# EAGLE design Eelctric Imp hydro board (EAGLE 6.5.0)
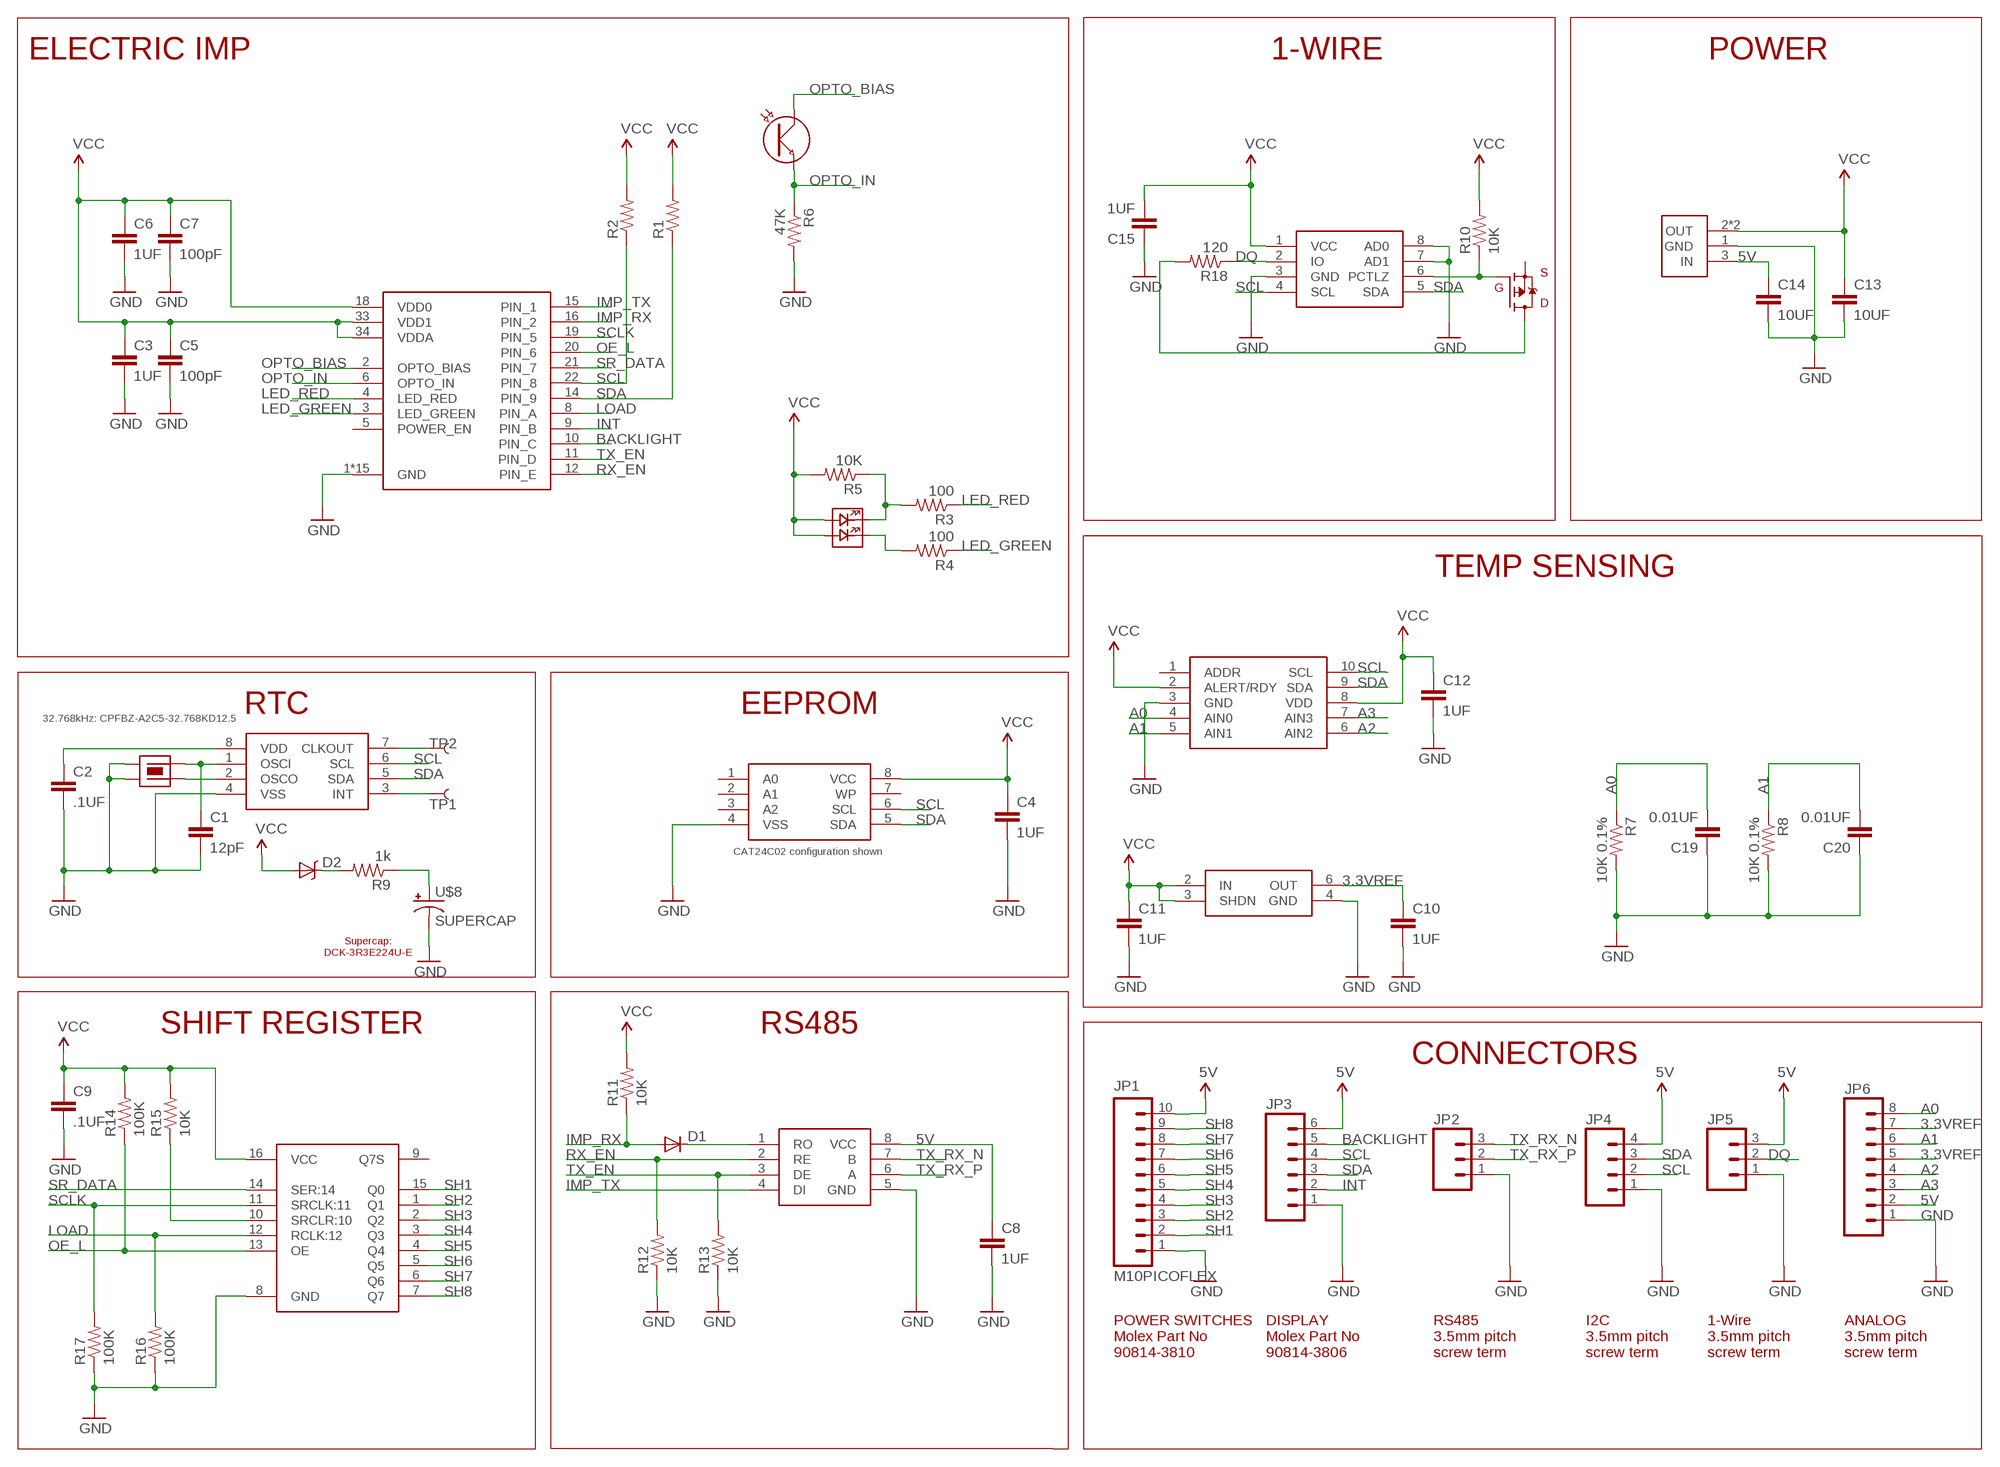
[diagram p0: schematic, sheet 1]

## Parts
C1  12pF  CAP0805  [0805]
C2  .1UF  CAP0805  [0805]
C3  1UF  CAP0805  [0805]
C4  1UF  CAP0805  [0805]
C5  100pF  CAP0805  [0805]
C6  1UF  CAP0805  [0805]
C7  100pF  CAP0805  [0805]
C8  1UF  CAP0805  [0805]
C9  .1UF  CAP0805  [0805]
C10  1UF  CAP0805  [0805]
C11  1UF  CAP0805  [0805]
C12  1UF  CAP0805  [0805]
C13  10UF  CAP0805  [0805]
C14  10UF  CAP0805  [0805]
C15  1UF  CAP0805  [0805]
C19  0.01UF  CAP0805  [0805]
C20  0.01UF  CAP0805  [0805]
D1  DIODESOD  [SOD-323]
D2  DIODE-SCHOTTKY_  [SMA-DIODE]
JP1  M10PICOFLEX  [CONNECTOR_MOLEX_PICOFLEX_10]
JP2  M03SCREW_LOCK  [SCREWTERMINAL-3.5MM-3_LOCK.007S]
JP3  M06PICOFLEX  [CONNECTOR_MOLEX_PICOFLEX_6]
JP4  M04SCREW_LOCK  [SCREWTERMINAL-3.5MM-4_LOCK]
JP5  M03SCREW_LOCK  [SCREWTERMINAL-3.5MM-3_LOCK.007S]
JP6  M083.5MM-8  [SCREWTERMINAL-3.5MM-8]
R1  RESISTOR0805-RES  [0805]
R2  RESISTOR0805-RES  [0805]
R3  100  RESISTOR0805-RES  [0805]
R4  100  RESISTOR0805-RES  [0805]
R5  10K  RESISTOR0805-RES  [0805]
R6  47K  RESISTOR0805-RES  [0805]
R7  10K 0.1%  RESISTOR0805-RES  [0805]
R8  10K 0.1%  RESISTOR0805-RES  [0805]
R9  1k  RESISTOR0805-RES  [0805]
R10  10K  RESISTOR0805-RES  [0805]
R11  10K  RESISTOR0805-RES  [0805]
R12  10K  RESISTOR0805-RES  [0805]
R13  10K  RESISTOR0805-RES  [0805]
R14  100K  RESISTOR0805-RES  [0805]
R15  10K  RESISTOR0805-RES  [0805]
R16  100K  RESISTOR0805-RES  [0805]
R17  100K  RESISTOR0805-RES  [0805]
R18  120  RESISTOR0805-RES  [0805]
TP1  TEST-POINT3  [PAD.03X.03]
TP2  TEST-POINT3  [PAD.03X.03]
U$1  RTC_PCF8563  [SOIC8]
U$2  CRYSTAL_4PIN232.768KHZ_ABS25  [CRYSTAL_ABS25]
U$3  EEPROM_CAT24CXX  [SOIC8]
U$4  RF_MODULE_IMP002  [RF_MODULE_IMP002]
U$5  LED_BI_COLOR_4PIN  [LED_LITEON_BICOLOR_TOP]
U$6  PHOTOTRANSISTOR0805  [0805POL]
U$8  SUPERCAP  [SUPERCAP_ELENA_DCK_3R3E224U-E]
U$9  DS2482-100  [SO08]
U$10  SHIFT_NXP_74HC595  [SO-16]
U$11  V_REG_LDO_3SOT-223-4_TI_TLV1117LV  [SOT223]
U$12  TRANSCEIVER_ST485  [SOIC8]
U$13  ADC_ADS1115  [MSOP10]
U$15  VREF_LT1461  [SOIC8]
U$16  MOSFET-P-CHANNELBSS84  [SOT23]

## Nets
3.3VREF: C10.1 JP6.5 JP6.7 U$15.6(OUT)
5V: C8.1 C14.1 JP1.10 JP3.6 JP4.4 JP5.3 JP6.2 U$11.3(IN) U$12.8(VCC)
A0: C19.2 JP6.8 R7.1 U$13.4(AIN0)
A1: C20.2 JP6.6 R8.1 U$13.5(AIN1)
A2: JP6.4 U$13.6(AIN2)
A3: JP6.3 U$13.7(AIN3)
BACKLIGHT: JP3.5 U$4.10(PIN_C)
DQ: JP5.2 R18.1 U$9.2(IO)
GND: C1.2 C2.2 C3.2 C4.2 C5.2 C6.2 C7.2 C8.2 C9.2 C10.2 C11.2 C12.2 C13.2 C14.2 C15.1 C19.1 C20.1 JP1.1 JP2.1 JP3.1 JP4.1 JP5.1 JP6.1 R6.2 R7.2 R8.2 R12.1 R13.1 R16.1 R17.1 U$1.4(VSS) U$2.2(CASE2) U$2.3(CASE1) U$3.4(VSS) U$4.1(GND) U$4.7(GND) U$4.13(GND) U$4.17(GND) U$4.23(GND) U$4.24(GND) U$4.25(GND) U$4.26(GND) U$4.27(GND) U$4.28(GND) U$4.29(GND) U$4.30(GND) U$4.31(GND) U$4.32(GND) U$4.35(GND) U$8.- U$9.3(GND) U$9.7(AD1) U$9.8(AD0) U$10.8(GND) U$11.1(GND) U$12.5(GND) U$13.3(GND) U$15.4(GND)
IMP_RX: D1.2(A) R11.1 U$4.16(PIN_2)
IMP_TX: U$4.15(PIN_1) U$12.4(DI)
INT: JP3.2 U$4.9(PIN_B)
LED_GREEN: R4.1 U$4.3(LED_GREEN)
LED_RED: R3.1 U$4.4(LED_RED)
LOAD: R16.2 U$4.8(PIN_A) U$10.12(RCLK:12)
N$1: R18.2 U$16.3(D)
N$2: C1.1 U$1.1(OSCI) U$2.1
N$3: U$1.2(OSCO) U$2.4
N$4: TP1.P$1 U$1.3(INT)
N$5: TP2.P$1 U$1.7(CLKOUT)
N$6: D2.C R9.2
N$8: R3.2 R5.1 U$5.LONG-
N$9: R15.1 U$10.10(SRCLR:10)
N$10: R4.2 U$5.SHORT-
N$12: R10.1 U$9.6(PCTLZ) U$16.1(G)
OE_L: R14.1 U$4.20(PIN_6) U$10.13(OE)
OPTO_BIAS: U$4.2(OPTO_BIAS) U$6.1(MARKING)(COLLECTOR)
OPTO_IN: R6.1 U$4.6(OPTO_IN) U$6.2(EMITTER)
RO: D1.1(C) U$12.1(RO)
RX_EN: R12.2 U$4.12(PIN_E) U$12.2(RE)
SCL: JP3.4 JP4.2 R2.1 U$1.6(SCL) U$3.6(SCL) U$4.22(PIN_8) U$9.4(SCL) U$13.10(SCL)
SCLK: R17.2 U$4.19(PIN_5) U$10.11(SRCLK:11)
SDA: JP3.3 JP4.3 R1.1 U$1.5(SDA) U$3.5(SDA) U$4.14(PIN_9) U$9.5(SDA) U$13.9(SDA)
SH1: JP1.2 U$10.15(Q0)
SH2: JP1.3 U$10.1(Q1)
SH3: JP1.4 U$10.2(Q2)
SH4: JP1.5 U$10.3(Q3)
SH5: JP1.6 U$10.4(Q4)
SH6: JP1.7 U$10.5(Q5)
SH7: JP1.8 U$10.6(Q6)
SH8: JP1.9 U$10.7(Q7)
SR_DATA: U$4.21(PIN_7) U$10.14(SER:14)
TX_EN: R13.2 U$4.11(PIN_D) U$12.3(DE)
TX_RX_N: JP2.3 U$12.7(B)
TX_RX_P: JP2.2 U$12.6(A)
VCC: C3.1 C4.1 C5.1 C6.1 C7.1 C9.1 C11.1 C12.1 C13.1 C15.2 D2.A R1.2 R2.2 R5.2 R10.2 R11.2 R14.2 R15.2 U$3.8(VCC) U$4.18(VDD0) U$4.33(VDD1) U$4.34(VDDA) U$5.LONG+ U$5.SHORT+ U$9.1(VCC) U$10.16(VCC) U$11.2(OUT) U$11.4(OUT) U$13.2(ALERT/RDY) U$13.8(VDD) U$15.2(IN) U$15.3(SHDN)
VCLK: C2.1 R9.1 U$1.8(VDD) U$8.+
Unconnected: U$3.1(A0) U$3.2(A1) U$3.3(A2) U$3.7(WP) U$4.5(POWER_EN) U$10.9(Q7S) U$13.1(ADDR) U$16.2(S)

## Notes on the sheet
- ELECTRIC IMP | 1-WIRE | POWER
- TEMP SENSING
- RTC | EEPROM
- 32.768kHz: CPFBZ-A2C5-32.768KD12.5
- Supercap:
  DCK-3R3E224U-E
- SHIFT REGISTER | RS485
- CONNECTORS
- POWER SWITCHES
  Molex Part No
  90814-3810
- DISPLAY
  Molex Part No
  90814-3806
- RS485
  3.5mm pitch 
  screw term
- I2C
  3.5mm pitch 
  screw term
- 1-Wire
  3.5mm pitch 
  screw term
- ANALOG
  3.5mm pitch 
  screw term

## Library data of the parts
C1-C15 C19 C20 = 2. ee_projects:CAP: Capacitor Standard 0603 ceramic capacitor, and 0.1" leaded capacitor.
D1 = 10.SparkFun:DIODE: Diode These are standard reverse protection diodes and small signal diodes. SMA package can handle up to about 1A. SOD-323 can handle about 200mA. What the SOD-323 package when ordering, there are some mfgs out there that are 5-pin packages.
D2 = 10.SparkFun:DIODE-SCHOTTKY
JP1 = 2. ee_projects:M10: Header 10 Standard 10-pin 0.1" header. Use with straight break away headers (SKU : PRT-00116), right angle break away headers (PRT-00553), swiss pins (PRT-00743), machine pins (PRT-00117), and female headers (PRT-00115).
JP2 JP5 = 12.ee_projects:M03: Header 3 Standard 3-pin 0.1" header. Use with straight break away headers (SKU : PRT-00116), right angle break away headers (PRT-00553), swiss pins (PRT-00743), machine pins (PRT-00117), and female headers (PRT-00115). Molex polarized connector foot print use with SKU : PRT-08232 with associated crimp pins and housings.
JP3 = 2. ee_projects:M06: Header 6 Standard 6-pin 0.1" header. Use with straight break away headers (SKU : PRT-00116), right angle break away headers (PRT-00553), swiss pins (PRT-00743), machine pins (PRT-00117), and female headers (PRT-00115). Molex polarized connector foot print use with SKU : PRT-08094 with associated crimp pins and housings. NOTES ON THE VARIANTS LOCK and LOCK_LONGPADS... This footprint was designed to help hold the alignment of a through-hole component (i.e. 6-pin header) while soldering it into place. You may notice that each hole has been shifted either up or down by 0.005 of an inch from it's more standard position (which is a perfectly straight line). This slight alteration caused the pins (the squares in the middle) to touch the edges of the holes. Because they are alternating, it causes a "brace" to hold the component in place. 0.005 has proven to be the perfect amount of "off-center" position when using our standard breakaway headers. Although looks a little odd when you look at the bare footprint, once you have a header in there, the alteration is very hard to notice. Also, if you push a header all the way into place, it is covered up entirely on the bottom side. This idea of altering the position of holes to aid alignment will be further integrated into the Sparkfun Library for other footprints. It can help hold any component with 3 or more connection pins.
JP4 = 12.ee_projects:M04: Header 4 Standard 4-pin 0.1" header. Use with straight break away headers (SKU : PRT-00116), right angle break away headers (PRT-00553), swiss pins (PRT-00743), machine pins (PRT-00117), and female headers (PRT-00115). Molex polarized connector foot print use with SKU : PRT-08231 with associated crimp pins and housings. 1MM SMD Version SKU: PRT-10208
JP6 = 2. ee_projects:M08: Header 8 Standard 8-pin 0.1" header. Use with straight break away headers (SKU : PRT-00116), right angle break away headers (PRT-00553), swiss pins (PRT-00743), machine pins (PRT-00117), and female headers (PRT-00115).
R1-R18 = 2. ee_projects:RESISTOR: Resistor Basic schematic elements and footprints for 0603, 1206, and PTH resistors.
TP1 TP2 = 10.SparkFun:TEST-POINT
U$1 = 2. ee_projects:RTC_PCF8563
U$2 = 2. ee_projects:CRYSTAL_4PIN2
U$3 = 2. ee_projects:EEPROM_CAT24CXX
U$4 = 2. ee_projects:RF_MODULE_IMP002
U$5 = 2. ee_projects:LED_BI_COLOR_4PIN
U$6 = 2. ee_projects:PHOTOTRANSISTOR
U$8 = 2. ee_projects:SUPERCAP
U$9 = 2. ee_projects:DS2482-100
U$10 = 2. ee_projects:SHIFT_NXP_74HC595
U$11 = 12.ee_projects:V_REG_LDO_3
U$12 = 2. ee_projects:TRANSCEIVER_ST485
U$13 = 2. ee_projects:ADC_ADS1115
U$15 = 2. ee_projects:VREF_LT1461
U$16 = 2. ee_projects:MOSFET-P-CHANNEL

## Board
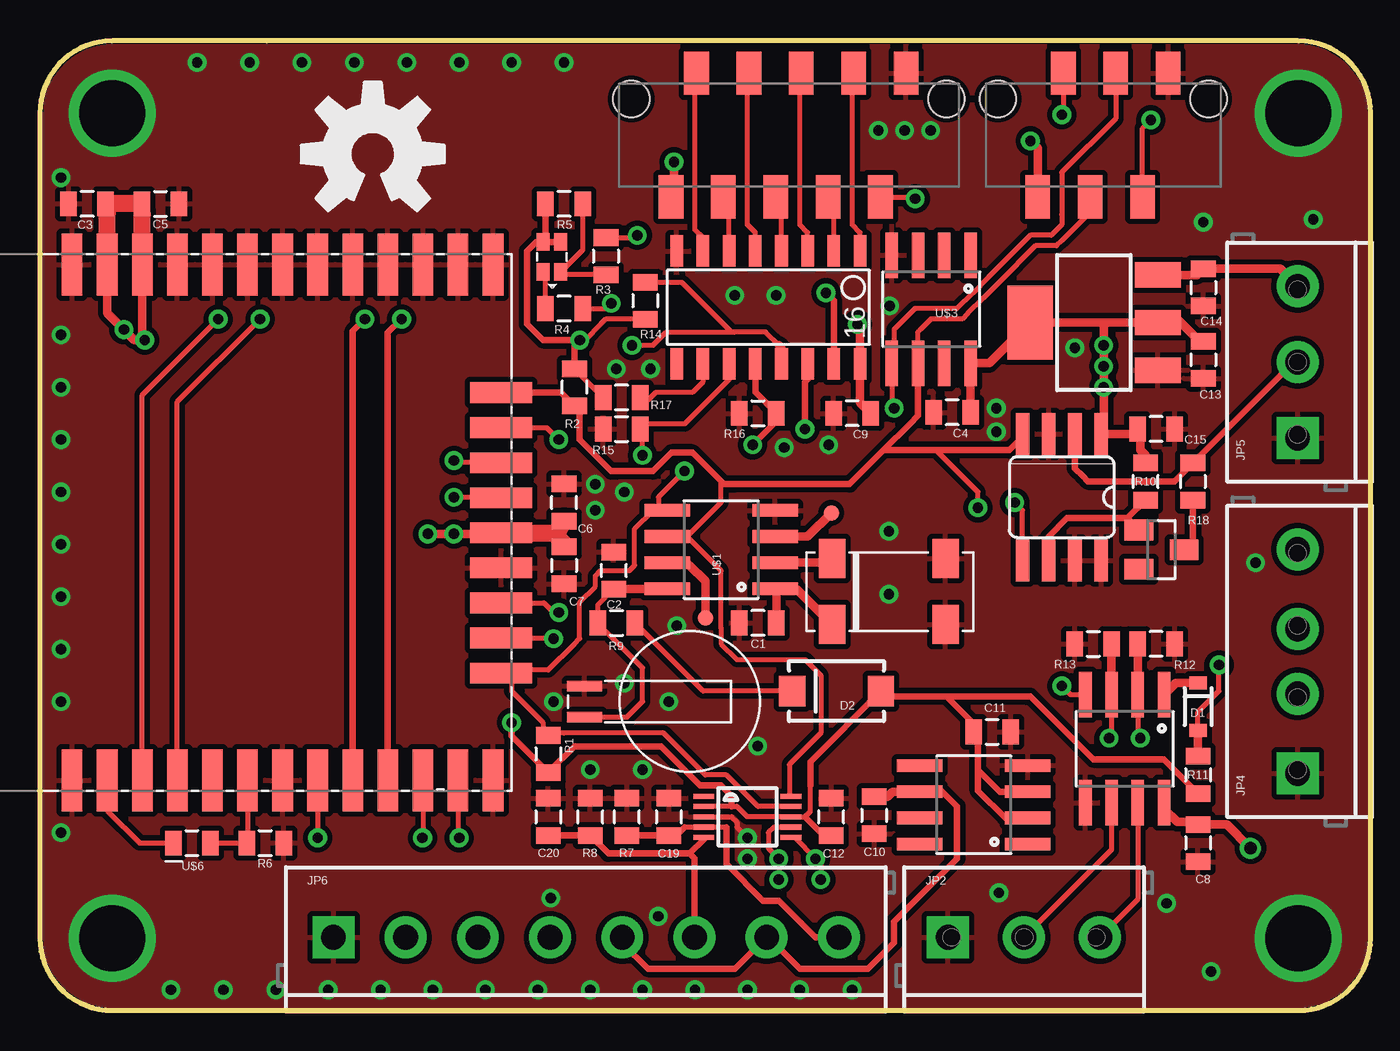
[diagram p1: board, top side]
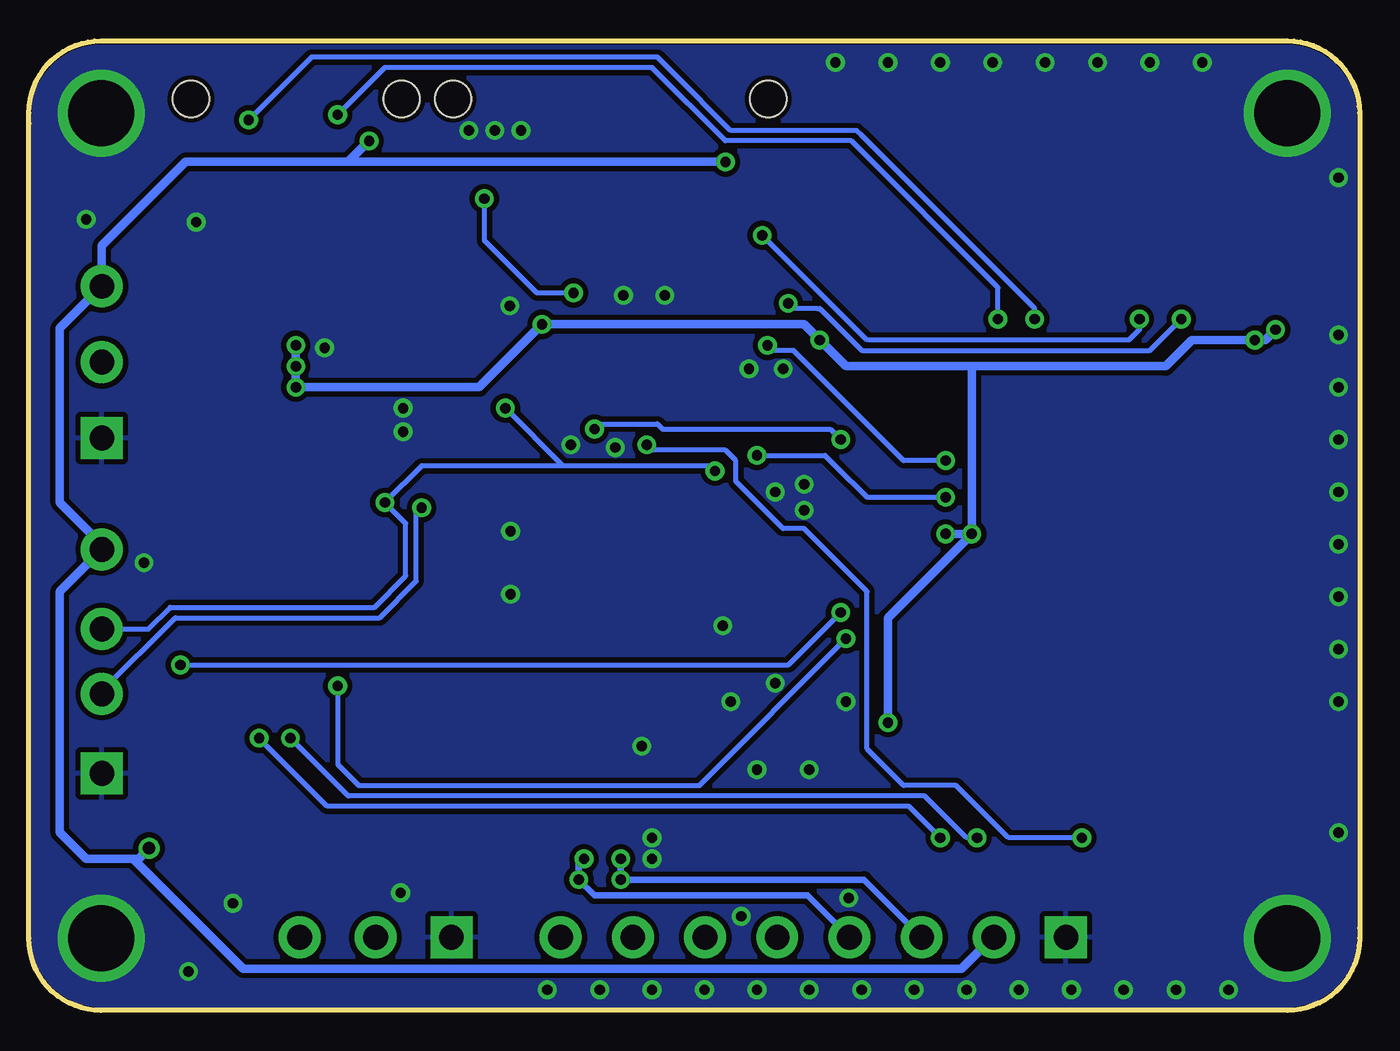
[diagram p2: board, bottom side, seen from below]

No outline drawn. Coordinates in mm, seen from the top.
Copper layers (1*16): Top 0.035mm / dielectric 1.5mm / Bottom 0.035mm
Design rules "default *": minimum track width 6mil, minimum drill 24mil, track to track 6mil, track to pad 6mil, pad to pad 6mil, via to via 6mil, smd to smd 6mil, copper to edge 10mil, drill to drill 8mil, minimum pad ring 10mil, minimum via ring 8mil, stop-mask expansion 4mil, vias tented up to drill 20mil, thermal gap 10mil
Milling: 11 lines

### Footprints (pad centres in the part's own frame; a part is rotated, then mirrored left to right if it is on the bottom)
0805 = smd 0.8 x 1.2: 1 -0.9,0; 2 0.9,0
SOD-323 = smd 0.63 x 0.83: 1 -1.15,0; 2 1.15,0
SMA-DIODE = smd 1.27 x 1.47: A -2.15,0; C 2.15,0
CONNECTOR_MOLEX_PICOFLEX_10 = smd 1.2 x 2.1: 1 1.96,-1.25; 2 3.2,4.75; 3 4.5,-1.25; 4 5.74,4.75; 5 7.04,-1.25; 6 8.28,4.75; 7 9.58,-1.25; 8 10.82,4.75; 9 12.12,-1.25; 10 13.36,4.75 | hole 1.75: 0,0; 15.28,0
SCREWTERMINAL-3.5MM-3_LOCK.007S = drill 1.2 pad 2.032 square: 1 -0.178,0 | drill 1.2 pad 2.032: 2 3.5,0; 3 7.178,0
CONNECTOR_MOLEX_PICOFLEX_6 = smd 1.2 x 2.1: 1 1.96,-1.25; 2 3.2,4.75; 3 4.5,-1.25; 4 5.74,4.75; 5 7.04,-1.25; 6 8.28,4.75 | hole 1.75: 0,0; 10.211,0
SCREWTERMINAL-3.5MM-4_LOCK = drill 1.2 pad 2.032 square: 1 -0.178,0 | drill 1.2 pad 2.032: 2 3.678,0; 3 6.822,0; 4 10.678,0
SCREWTERMINAL-3.5MM-8 = drill 1.2 pad 2.032 square: 1 0,0 | drill 1.2 pad 2.032: 2 3.5,0; 3 7,0; 4 10.5,0; 5 14,0; 6 17.5,0; 7 21,0; 8 24.5,0
PAD.03X.03 = smd 0.762 x 0.762: P$1 0,0
SOIC8 = smd 0.61 x 2.21: 1 -1.905,-2.616; 2 -0.635,-2.616; 3 0.635,-2.616; 4 1.905,-2.616; 5 1.905,2.616; 6 0.635,2.616; 7 -0.635,2.616; 8 -1.905,2.616
CRYSTAL_ABS25 = smd 1.3 x 1.9: 1 -2.75,-1.6; 2 2.75,-1.6; 3 2.75,1.6; 4 -2.75,1.6
RF_MODULE_IMP002 = smd 3 x 1: 1 0.5,21.3; 2 0.5,19.6; 3 0.5,17.9; 4 0.5,16.2; 5 0.5,14.5; 6 0.5,12.8; 7 0.5,11.1; 8 0.5,9.4; 9 0.5,7.7; 10 0.5,6; 11 0.5,4.3; 12 0.5,2.6; 13 0.5,0.9; 23 25.5,0.9; 24 25.5,2.6; 25 25.5,4.3; 26 25.5,6; 27 25.5,7.7; 28 25.5,9.4; 29 25.5,11.1; 30 25.5,12.8; 31 25.5,14.5; 32 25.5,16.2; 33 25.5,17.9; 34 25.5,19.6; 35 25.5,21.3 | smd 1 x 3: 14 5.7,0.5; 15 7.4,0.5; 16 9.1,0.5; 17 10.8,0.5; 18 12.5,0.5; 19 14.2,0.5; 20 15.9,0.5; 21 17.6,0.5; 22 19.3,0.5
LED_LITEON_BICOLOR_TOP = smd 0.65 x 0.85: LONG+ 0.85,1.45; LONG- 0.85,0; SHORT+ 0,1.45; SHORT- 0,0
0805POL = smd 0.8 x 1.2: 1(MARKING) -0.9,0; 2 0.9,0
SUPERCAP_ELENA_DCK_3R3E224U-E = smd 0.5 x 1.7: + 0.75,-5.1; - -0.75,-5.1
SO08 = smd 0.66 x 2.032: 1 -1.905,-3.073; 2 -0.635,-3.073; 3 0.635,-3.073; 4 1.905,-3.073; 5 1.905,3.073; 6 0.635,3.073; 7 -0.635,3.073; 8 -1.905,3.073
SO-16 = smd 0.61 x 1.524: 1 -4.445,-2.794; 2 -3.175,-2.794; 3 -1.905,-2.794; 4 -0.635,-2.794; 5 0.635,-2.794; 6 1.905,-2.794; 7 3.175,-2.794; 8 4.445,-2.794; 9 4.445,2.667; 10 3.175,2.667; 11 1.905,2.667; 12 0.635,2.667; 13 -0.635,2.667; 14 -1.905,2.667; 15 -3.175,2.667; 16 -4.445,2.667
SOT223 = smd 1.219 x 2.235: 1 -2.311,-3.099; 2 0,-3.099; 3 2.311,-3.099 | smd 3.6 x 2.2: 4 0,3.099
MSOP10 = smd 0.25 x 1: 1 -1,-2.113; 2 -0.5,-2.113; 3 0,-2.113; 4 0.5,-2.113; 5 1,-2.113; 6 1,2.113; 7 0.5,2.113; 8 0,2.113; 9 -0.5,2.113; 10 -1,2.113
SOT23 = smd 1 x 1.4: 1 -0.95,-1.1; 2 0.95,-1.1; 3 0,1.1

### Placement (x,y rotation side)
C1  34.8,17.78 180 top
C2  27.81,20.32 90 top
C3  2.29,38.1 180 top
C4  44.21,27.99 180 top
C5  5.84,38.1 0 top
C6  25.4,23.62 90 top
C7  25.4,20.57 270 top
C8  56.13,7.11 270 top
C9  39.37,27.94 180 top
C10  40.44,8.46 270 top
C11  46.15,12.5 0 top
C12  38.35,8.38 90 top
C13  56.39,30.54 270 top
C14  56.39,34.05 270 top
C15  54.1,27.18 180 top
C19  30.48,8.38 270 top
C20  24.64,8.38 270 top
D1  56.13,13.72 270 top
D2  38.61,14.48 180 top
JP1  43.94,43.18 180 top
JP2  44.2,2.54 0 top
JP3  56.64,43.18 180 top
JP4  60.96,10.67 90 top
JP5  60.96,26.92 90 top
JP6  14.22,2.54 0 top
R1  24.64,11.43 270 top
R2  25.91,29.21 90 top
R3  27.43,35.56 270 top
R4  25.4,33.02 180 top
R5  25.4,38.1 180 top
R6  10.92,7.11 0 top
R7  28.45,8.38 90 top
R8  26.67,8.38 90 top
R9  27.94,17.78 0 top
R10  53.59,24.64 90 top
R11  56.13,10.41 270 top
R12  54.1,16.76 180 top
R13  51.05,16.76 0 top
R14  29.34,33.4 270 top
R15  28.19,28.7 180 top
R16  34.8,27.94 0 top
R17  28.19,27.18 0 top
R18  55.88,24.64 270 top
TP1  38.35,23.11 90 top
TP2  32.26,18.03 90 top
U$1  33.02,21.34 90 top
U$2  41.15,19.3 0 top
U$3  43.2,32.99 180 top
U$4  22.86,9.65 90 top
U$5  24.38,34.8 0 top
U$6  7.37,7.11 0 top
U$7  [OSHW-LOGO-L]  16.13,40.51 0 top
U$8  31.5,13.97 270 top
U$9  49.53,23.88 180 top
U$10  35.31,33.02 180 top
U$11  51.08,32.34 90 top
U$12  52.58,11.68 180 top
U$13  34.29,8.38 270 top
U$15  45.26,8.97 90 top
U$16  54.36,21.34 270 top

### Tracks (layer width: path | path; a pad name or v marks a point on that pad's centre or on a via)
3.3VREF
  Top 0.305: JP6.5 28.22,2.26 29.46,1.02 33.7,1.02 JP6.7 35.31,2.54 36.83,1.02 39.62,1.02 40.13,1.02 41.4,2.29 41.4,3.3 44.45,6.35 44.45,8.89 43.69,9.65 42.7,9.65 U$15.6
  Top 0.406: C10.1 41.08,9.36 41.2,9.47 41.33,9.6 U$15.6
5V  (via drill 0.5, 0.61)
  Top 0.406: v30.73,40.13 30.73,38.58 JP1.10 | JP3.6 48.36,40.79 v48.01,41.15 | U$11.3 56.1,34.65 C14.1 60.12,34.95 JP5.3 | U$12.8 54.48,8.76 55.12,8.13 56.02,8.13 C8.1 57.52,8.01 v58.67,6.86
  Bottom 0.406: JP6.2 17.78,2.54 19.3,1.02 54.1,1.02 59.44,6.35 | 59.44,6.35 61.72,6.35 62.99,7.62 62.99,19.31 JP4.4 60.96,21.59 62.99,23.62 62.99,32.07 JP5.3 60.96,36.07 56.9,40.13 49.02,40.13 | 49.02,40.13 v48.01,41.15 49.02,40.13 | 49.02,40.13 v30.73,40.13 | 59.44,6.35 59.18,6.35 v58.67,6.86
A0
  Top 0.254: 31.25,7.88 U$13.4 33.27,7.87
  Top 0.305: R7.1 C19.2 30.85,7.48 31.24,7.87 31.25,7.88 | JP6.8 38.61,2.54 37.59,2.54 35.81,4.32 35.05,4.32 33.27,6.1 33.27,7.87
A1
  Top 0.254: U$13.5 32.18,7.29
  Top 0.305: 32.18,7.29 31.5,6.6 | 31.5,6.6 27.55,6.6 R8.1 C20.2 | JP6.6 31.72,6.38 31.5,6.6
A2  (via drill 0.5)
  Top 0.254: U$13.6 36.56,7.38 v37.59,6.35 37.85,6.1 v37.85,5.33
  Bottom 0.305: v37.85,5.33 37.85,6.1 | 37.85,6.1 v37.59,6.35 37.85,6.1 | 37.85,6.1 v37.85,5.33 | v37.85,5.33 37.08,4.57 26.76,4.57 JP6.4
A3  (via drill 0.5)
  Top 0.254: U$13.7 35.57,7.88 35.31,7.62 35.31,6.86 v35.81,6.35 v35.81,5.33
  Bottom 0.305: v35.81,5.33 v35.81,6.35 v35.81,5.33 | v35.81,5.33 24.02,5.33 JP6.3
BACKLIGHT  (via drill 0.5)
  Top 0.254: JP3.5 49.6,42.49 v49.53,42.42
  Top 0.305: U$4.10 16.86,31.85 v17.53,32.51
  Bottom 0.254: v17.53,32.51 17.53,34.04 24.64,41.15 30.73,41.15 34.29,44.7 47.24,44.7 v49.53,42.42
DQ
  Top 0.305: JP5.2 60.77,30.42 R18.1 54.98,24.64 50.8,24.64 50.55,24.89 50.16,25.27 U$9.2
GND  (via drill 0.5, 3.2)
  Top 0.254: U$13.3 33.53,8.38 33.78,8.13 33.78,7.87 v34.29,7.37
  other vias: 1.02,13.97 1.02,16.51 1.02,19.05 1.02,21.59 1.02,24.13 1.02,26.67 1.02,29.21 1.02,31.75 1.02,7.62 6.35,0 8.89,0 11.43,0 1.02,39.37 7.62,44.96 10.16,44.96 12.7,44.96 15.24,44.96 17.78,44.96 20.32,44.96 22.86,44.96 13.97,0 25.4,44.96 16.51,0 19.05,0 21.59,0 24.13,0 26.67,0 29.21,0 31.75,0 34.29,0 36.83,0 39.37,0 34.29,6.35 29.21,10.67 26.67,10.67 24.89,13.97 28.32,14.86 26.92,24.51 28.32,24.13 46.35,27.05 46.35,28.19 50.16,31.11 40.64,41.66 41.91,41.66 43.18,41.66 26.92,23.24 29.59,30.1 38.23,26.42 36.07,26.29 30.48,13.97 34.8,11.81 30.86,17.65 24.77,4.45 29.97,3.56 27.94,30.1 41.15,22.23 41.15,19.18 46.48,4.7 54.61,4.19 56.77,0.89 58.93,20.7 56.39,37.21 61.72,37.34 3.5,2.5 3.5,42.5 61,42.5 61,2.5 33.68,33.66 35.68,33.66 41.18,33.16
  pour Top (isolate 0.254): 0.25,6.35 0.25,2.54 arc90 3.56,-0.76 60.96,-0.76 arc90 64.26,2.54 64.26,42.42 arc90 60.96,45.72 3.56,45.72 arc90 0.25,42.42
  pour Bottom (isolate 0.254): 0.25,6.35 0.25,2.54 arc90 3.56,-0.76 60.96,-0.76 arc90 64.26,2.54 64.26,42.42 arc90 60.96,45.72 3.56,45.72 arc90 0.25,42.42
IMP_RX  (via drill 0.5)
  Top 0.254: D1.2 56.13,13.46 57.15,14.48 v57.15,15.75 | U$4.16 24.43,18.75 24.89,18.29 v25.15,18.29
  Top 0.406: D1.2 R11.1
  Bottom 0.254: v57.15,15.75 27.69,15.75 v25.15,18.29
IMP_TX  (via drill 0.5)
  Top 0.254: U$12.4 49.96,14.3 v49.53,14.73 | U$4.15 24.86,17.05 v24.89,17.02
  Bottom 0.254: v49.53,14.73 49.53,10.92 48.51,9.91 32,9.91 v24.89,17.02
INT  (via drill 0.5)
  Top 0.254: JP3.2 53.44,41.76 v53.85,42.16
  Top 0.305: U$4.9 15.16,31.58 15.16,31.92 v15.75,32.51
  Bottom 0.254: v15.75,32.51 15.75,33.02 24.13,41.4 24.38,41.66 30.48,41.66 33.27,44.45 33.53,44.7 34.04,45.21 50.8,45.21 v53.85,42.16
LED_GREEN  (via drill 0.5)
  Top 0.254: U$4.3 4.96,28.84 v8.64,32.51 | R4.1 27.43,33.02 v27.69,33.27
  Bottom 0.254: v27.69,33.27 27.43,33.02 R4.1 26.16,33.02 24.13,30.99 10.16,30.99 v8.64,32.51
LED_RED  (via drill 0.5)
  Top 0.254: U$4.4 6.66,28.5 v10.67,32.51 | R3.1 28.84,36.46 v28.96,36.58
  Bottom 0.254: v28.96,36.58 24.89,32.51 23.88,31.5 11.18,31.5 10.67,32 v10.67,32.51
LOAD  (via drill 0.5)
  Top 0.254: U$4.8 v13.46,7.37
  Top 0.305: U$10.12 34.67,28.97 R16.2 35.7,27.57 v34.54,26.42
  Bottom 0.254: v13.46,7.37 17.02,7.37 19.56,9.91 22.1,9.91 23.88,11.68 23.88,19.3 26.92,22.35 27.94,22.35 30.23,24.64 30.23,25.65 30.73,26.16 34.29,26.16 v34.54,26.42
N$1
  Top 0.305: R18.2 55.88,21.76 U$16.3
N$2
  Top 0.406: U$2.1 36.67,19.43 U$1.1 35.7,19.37 C1.1
N$3
  Top 0.406: U$1.2 38.2,20.7 U$2.4
N$4
  Top 0.406: U$1.3 37.21,21.97 TP1.P$1
N$5
  Top 0.406: TP2.P$1 32.26,19.81 31.5,20.57 31.37,20.7 U$1.7
N$6
  Top 0.254: D2.C 32.14,14.48 R9.2
N$8
  Top 0.254: R5.1 26.3,35.86 U$5.LONG- 25.37,34.66 R3.2
N$9
  Top 0.254: U$10.10 32.13,29.46 31.62,28.96 29.84,28.96 29.46,28.57 29.08,28.56 R15.1
N$10
  Top 0.254: R4.2 24.5,34.68 U$5.SHORT-
N$12
  Top 0.305: U$9.6 48.9,21.97 49.78,22.86 52.72,22.86 | 52.72,22.86 R10.1 | U$16.1 53.26,22.32 52.72,22.86
OE_L  (via drill 0.5)
  Top 0.254: 35.81,31.24 35.17,31.89 33.66,31.89 | U$10.13 35.94,31.11 | U$4.20 20.17,25.55 v20.07,25.65 | 33.66,31.89 33.52,31.89 31.11,34.29 R14.1 | v28.7,31.24 29.72,31.24 30.35,31.88 33.64,31.88 33.66,31.89
  Top 0.406: 35.94,31.11 35.81,31.24
  Bottom 0.254: v20.07,25.65 22.1,25.65 27.43,30.99 28.45,30.99 v28.7,31.24
OPTO_BIAS
  Top 0.254: U$4.2 3.26,8.68 4.83,7.11 U$6.1(MARKING)
OPTO_IN
  Top 0.254: U$6.2 R6.1 10.06,7.15 U$4.6
RO
  Top 0.406: D1.1 55.05,14.87 U$12.1
RX_EN  (via drill 0.5)
  Top 0.254: U$4.12 20.26,7.43 v20.32,7.37 | U$12.2 53.21,12.32 v53.34,12.19
  Top 0.406: U$12.2 53.21,16.75 R12.2
  Bottom 0.254: v20.32,7.37 21.84,8.89 50.04,8.89 v53.34,12.19
SCL  (via drill 0.5)
  Top 0.254: U$3.6 42.56,31.89 42.67,32 43.18,32.51 44.2,32.51 44.7,32.51 44.96,32.77 45.72,33.53 46.48,34.29 48.26,36.07 49.28,36.07 49.53,36.32 50.9,37.69 50.9,38.2 | v45.47,23.37 45.47,24.13 43.43,26.16 | U$13.10 36.32,9.46 36.32,10.92 37.85,12.45 37.85,15.24 37.08,16 33.78,16 33.02,16.76 33.02,17.53 33.02,20.32 31.37,21.97 33.02,23.62 33.02,24.64 32.96,24.7
  Top 0.305: 40.89,26.16 42.16,27.43 42.56,27.83 U$3.6 | U$1.6 31.37,21.97 | JP3.4 50.9,38.2 | U$9.4 47.62,26.8 46.99,26.16 43.43,26.16 40.89,26.16 | U$4.22 25.27,28.95 R2.1 26.16,28.06 26.16,26.67 27.69,25.15 27.94,25.15 29.72,25.15 30.42,25.84 30.61,26.04 31.62,26.04 32.96,24.7 33.15,24.51 33.66,24.51 39.24,24.51 39.88,25.15 40.89,26.16
  Bottom 0.254: JP4.2 60.96,14.48 57.4,18.03 47.5,18.03 45.72,19.81 45.72,23.11 v45.47,23.37
SCLK  (via drill 0.5)
  Top 0.254: U$4.19 20.09,23.85 v20.07,23.88 | U$10.11 33.4,29.59 31.24,27.43 29.35,27.43 R17.2 29.21,27.06 v29.21,25.91
  Bottom 0.254: v29.21,25.91 25.91,25.91 25.4,25.4 23.88,23.88 v20.07,23.88
SDA  (via drill 0.5)
  Top 0.254: U$13.9 34.81,8.88 33.27,10.41 32.26,10.41 30.23,12.45 25.4,12.45 24.75,12.45 R1.1 24.38,12.58 24.38,12.95 22.86,14.48 22.86,15.24 23.11,15.49 24.64,15.49 | U$1.5 29.72,23.24 | 24.64,15.49 22.5,15.49 U$4.14 | JP3.3 52.14,42.24 49.53,39.62 49.53,37.59 49.53,37.08 49.02,36.58 48.01,36.58 45.97,34.54 45.21,33.78 44.45,33.02 42.42,33.02 41.4,32 41.4,30.48 U$3.5 41.29,28.3 v41.4,28.19 | U$9.5 47.62,23.24 v47.24,23.62 | v31.24,25.15 29.97,23.88 29.97,23.5 29.72,23.24 | 24.64,15.49 25.91,16.76 26.16,17.02 26.16,18.8 26.92,19.56 26.92,20.07 27.18,20.32 28.57,20.32 28.83,20.57 28.83,22.35 29.72,23.24
  Top 0.305: U$4.14 22.63,15.35
  Bottom 0.254: v31.24,25.15 31.5,25.4 38.61,25.4 | 38.61,25.4 v41.4,28.19 38.61,25.4 | 38.61,25.4 45.47,25.4 v47.24,23.62 46.74,23.11 46.23,22.61 46.23,20.07 47.75,18.54 57.66,18.54 58.71,17.49 JP4.3
SH1  (via drill 0.5)
  Top 0.254: JP1.2 42.34,38.43 v42.42,38.35
  Top 0.305: U$10.15 38.48,33.4 v38.1,33.78
  Bottom 0.254: v38.1,33.78 39.88,33.78 42.42,36.32 v42.42,38.35
SH2
  Top 0.254: U$10.1 39.75,36.7 39.37,37.08 39.37,44.44 JP1.3
SH3
  Top 0.254: U$10.2 38.48,38.09 JP1.4
SH4
  Top 0.254: U$10.3 37.21,36.7 36.83,37.08 36.83,44.44 JP1.5
SH5
  Top 0.254: U$10.4 35.94,38.09 JP1.6
SH6
  Top 0.254: U$10.5 34.67,36.7 34.29,37.08 34.29,44.44 JP1.7
SH7
  Top 0.254: U$10.6 33.4,38.09 JP1.8
SH8
  Top 0.254: U$10.7 32.13,36.45 31.75,36.83 31.75,44.44 JP1.9
SR_DATA  (via drill 0.5)
  Top 0.254: U$4.21 24.56,27.25 v25.15,26.67
  Top 0.305: U$10.14 37.21,29.59 37.08,29.46 v37.08,27.18
  Bottom 0.254: v37.08,27.18 36.83,27.43 34.04,27.43 33.78,27.18 25.65,27.18 v25.15,26.67
TX_EN  (via drill 0.5)
  Top 0.254: U$4.11 18.56,7.38 v18.54,7.37 | U$12.3 51.94,12.32 v51.82,12.19
  Top 0.406: U$12.3 R13.2
  Bottom 0.254: v18.54,7.37 19.05,7.37 21.08,9.4 49.02,9.4 v51.82,12.19
TX_RX_N
  Top 0.254: U$12.7 53.21,4.38 JP2.3
TX_RX_P
  Top 0.254: U$12.6 51.94,6.79 JP2.2
VCC  (via drill 0.5)
  Top 0.254: U$13.2 33.53,8.89 33.78,8.89 34.29,8.38 U$13.8 37.08,8.38 37.34,8.64 37.34,9.91 | 27.3,28.71 R15.2 26.18,29.81 26.18,30.09 | R14.2 27.42,32.5 27.18,32.26 26.42,31.5 v26.16,31.5
  Top 0.305: R5.2 24.5,36.36 U$5.SHORT+ U$5.LONG+ 24.06,36.25 23.62,35.81 23.62,32.26 24.38,31.5 v26.16,31.5 25.91,31.24 R2.2 26.18,30.09 | 21.84,22.1 22.31,22.1 U$4.18 | 43.94,14.22 47.75,14.22 48.01,14.22 51.05,11.18 54.47,11.18 R11.2 | 43.94,14.22 41.01,14.22 D2.A 37.34,11.06 37.34,9.91 | 43.94,14.22 45.25,12.91 C11.1 45.47,12.28 45.47,10.67 | U$15.2 46.79,8.33 45.47,9.65 45.47,10.67 | U$15.3 46.53,9.6 45.47,10.67 | C12.1 37.98,7.48 37.08,8.38 | 33.53,8.89 33.53,9.4 33.02,9.91 32,9.91 30.11,11.8 25.91,11.8 R1.2 22.86,12.31 v22.86,12.95
  Top 0.406: C4.1 45.1,28.51 U$3.8 46.02,30.38 U$11.4 51.56,32.34 | C9.1 39.75,28.46 U$10.16 39.75,32.13 v39.62,32.26 | 51.56,32.34 U$11.2 54.35,32.51 55.12,32.51 56.19,31.44 C13.1 | C15.2 52.97,26.95 U$9.1 51.56,27.08 v51.56,29.21 v51.56,30.23 v51.56,31.24 51.56,32.34 | R10.2 53.59,25.91 53.34,26.16 53.34,27.04 C15.2 | C15.2 53.09,27.18 | U$4.34 3.26,32.81 v4.06,32 4.57,31.5 v5.08,31.5 4.96,31.62 U$4.33 | 21.84,22.1 v20.07,22.1 v18.8,22.1
  Top 0.813: U$4.18 24.89,22.15 | 24.89,22.15 25.08,22.15 C6.1 | C7.1 25.4,21.64 24.89,22.15 | U$4.34 3.26,37.67 C3.1 C5.1 4.96,37.59 U$4.33
  Bottom 0.406: v51.56,31.24 v51.56,29.21 42.67,29.21 v39.62,32.26 26.92,32.26 v26.16,31.5 24.89,30.23 18.8,30.23 | v4.06,32 4.57,31.5 v5.08,31.5 8.13,31.5 9.4,30.23 18.54,30.23 18.8,30.23 | v18.8,22.1 v20.07,22.1 v18.8,22.1 | v18.8,22.1 18.8,30.23 | v22.86,12.95 22.86,18.03 v18.8,22.1
VCLK
  Top 0.254: U$8.+ 26.94,13.22 28.46,13.22 29.21,13.97 29.21,15.61 27.69,17.13 R9.1 27.04,18.27 27.04,18.65 C2.1
  Top 0.406: U$1.8 28.2,19.43 C2.1

### Text on the board
tValues: 10K | 1UF | 100PF | 100 | 100k | 100 | 10uf | 10uf | 4.7K | 10k | 1UF | 100k | 100k | 0.1uf | 1UF | 1UF | 10k | 120 | 0.1uf | 100pf | 10k | 10k | 1K | 12pf | 1UF | 4.7K | 1UF | 1UF | 10k | 47k | 1UF | 0.01UF | 10K .1% | 0.01UF | 10K .1%